# EAGLE schematic eagle-schematic (EAGLE 9.6.2)
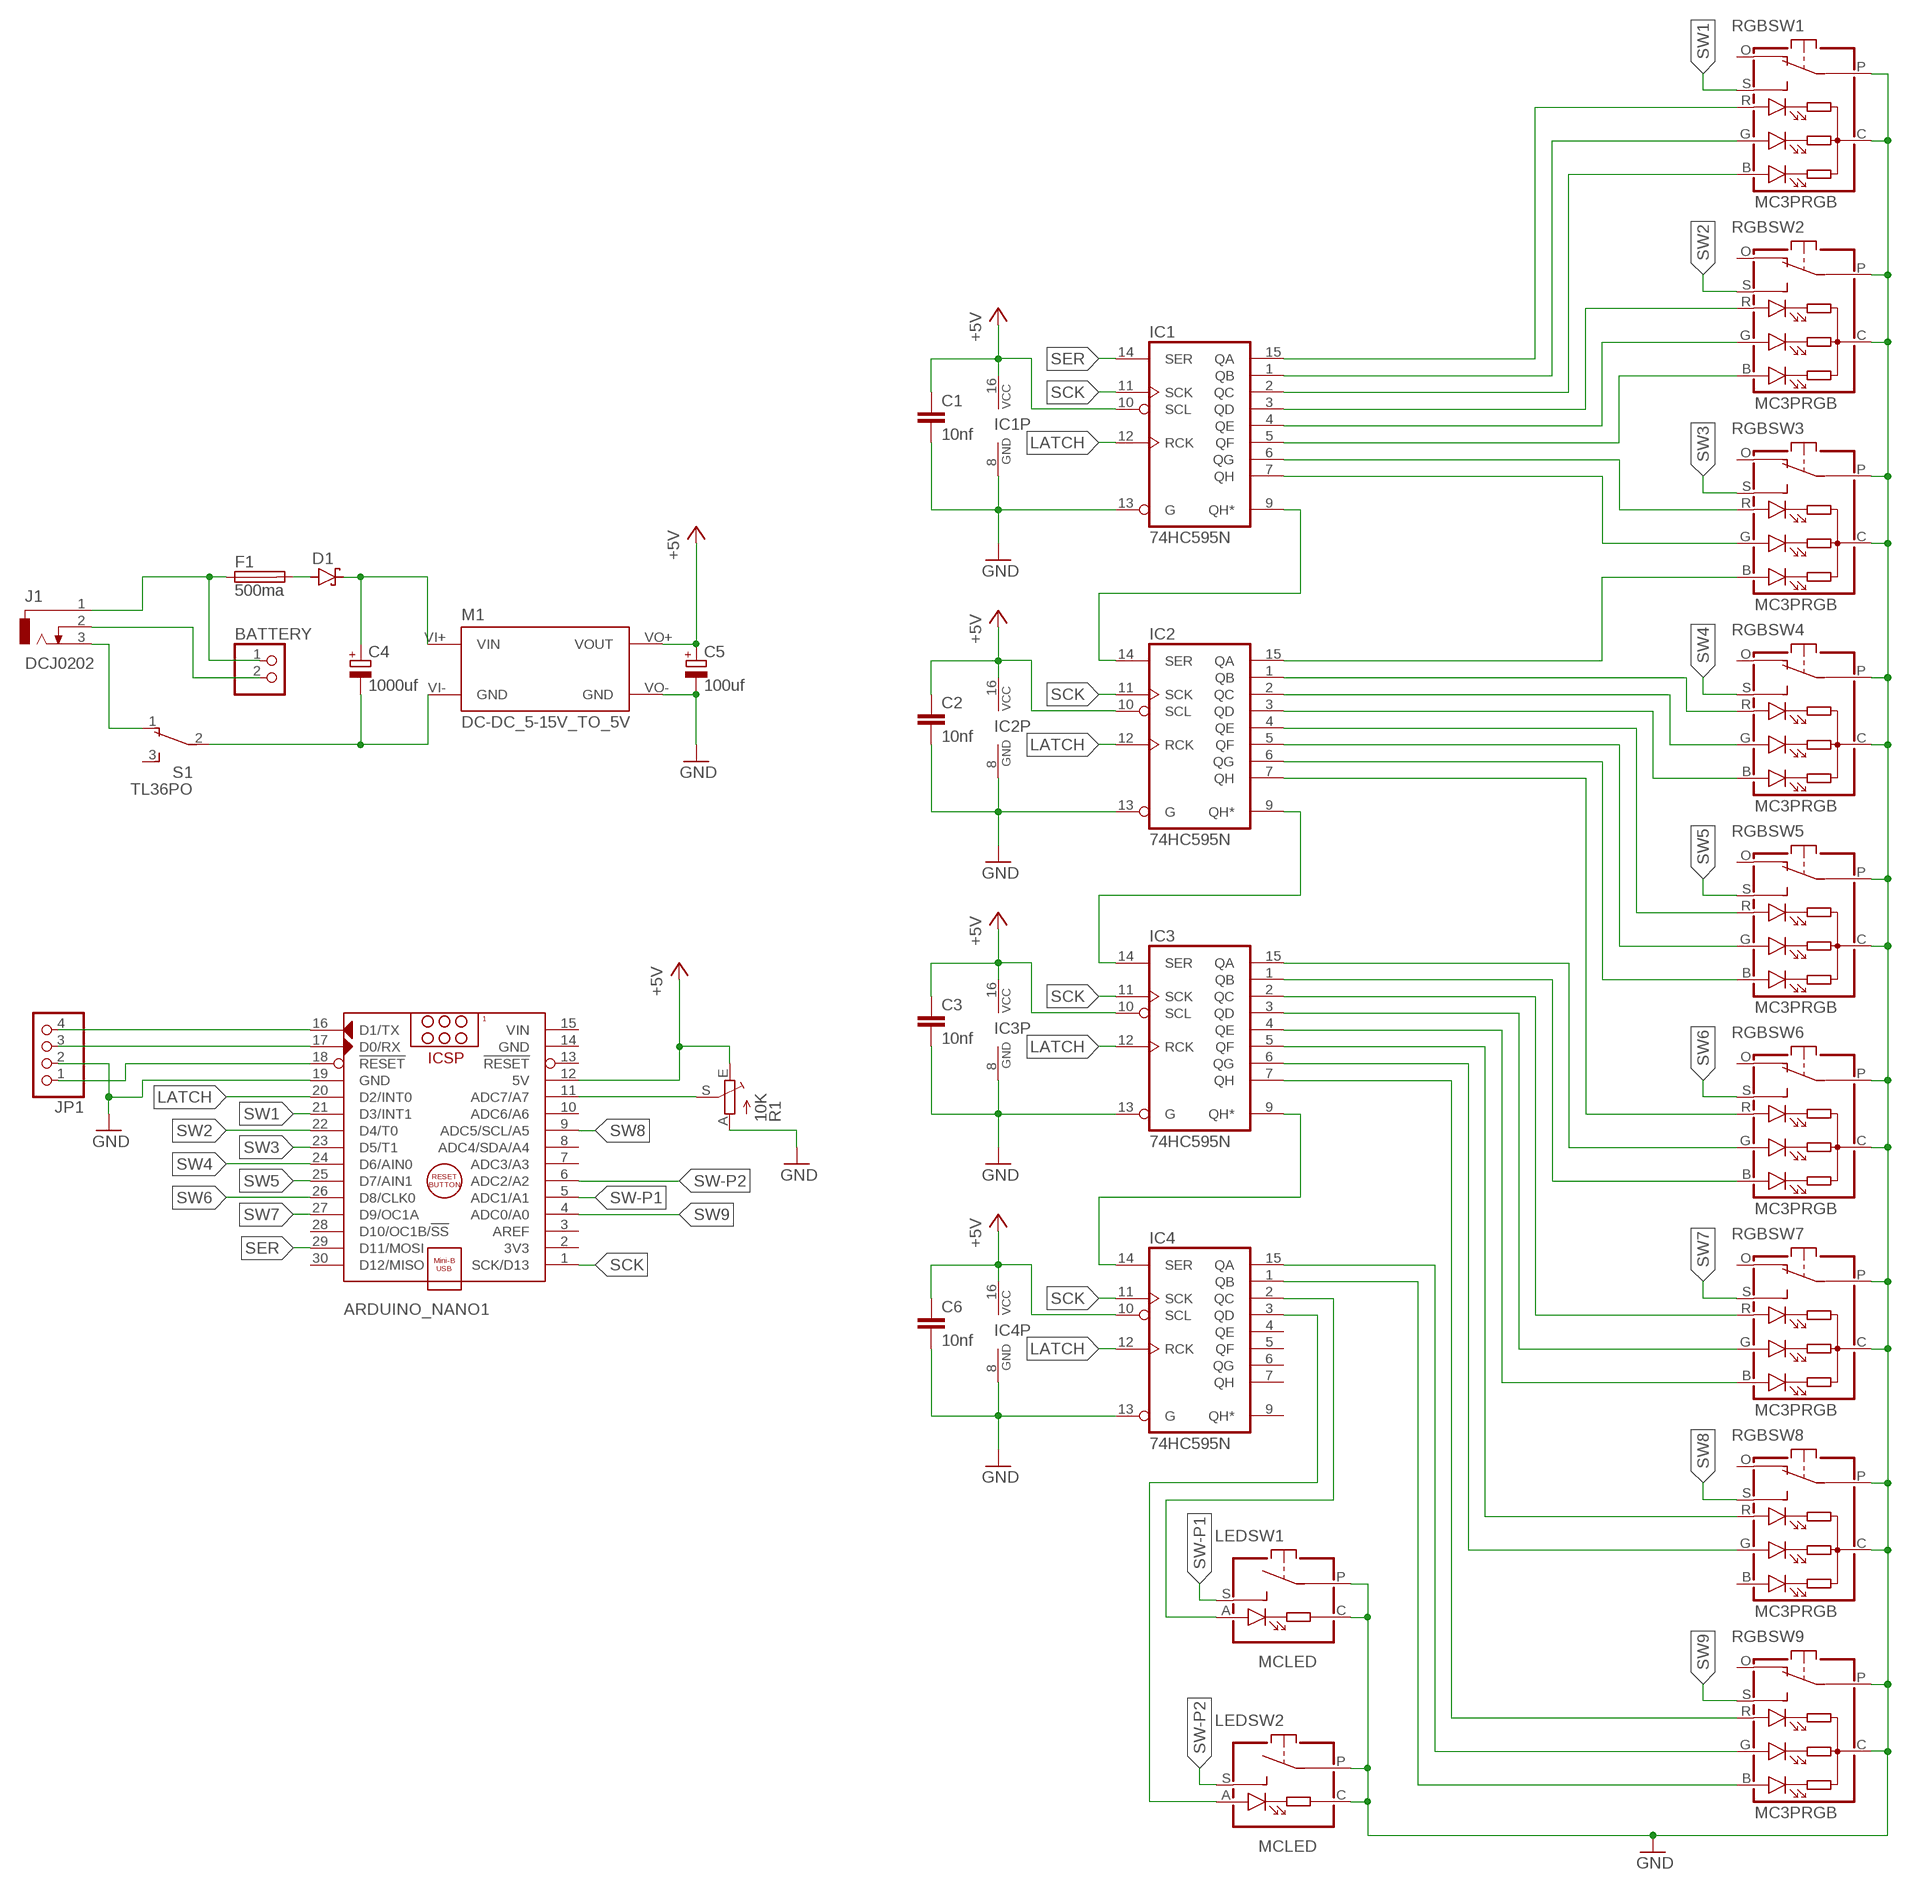
[diagram p0: schematic, sheet 1]

## Parts
ARDUINO_NANO1  ARDUINO_NANO  [ARDUINO_NANO]
BATTERY  PINHD-1X2  [1X02]
C1  10nf  C-EU025-024X044  [C025-024X044]
C2  10nf  C-EU025-024X044  [C025-024X044]
C3  10nf  C-EU025-024X044  [C025-024X044]
C4  1000uf  CPOL-EUE5-13  [E5-13]
C5  100uf  CPOL-EUE2.5-5  [E2,5-5]
C6  10nf  C-EU025-024X044  [C025-024X044]
D1  SCHOTTKY-DIODECB417-15  [CB417-15]
F1  500ma  FUSEBLANK_5X20MM  [FUSE_HOLDER_5X20MM]
IC1  74HC595N  [DIL16]
IC2  74HC595N  [DIL16]
IC3  74HC595N  [DIL16]
IC4  74HC595N  [DIL16]
J1  DCJ0202  [DCJ0202]
JP1  PINHD-1X4  [1X04]
LEDSW1  MCLED  [1X04]
LEDSW2  MCLED  [1X04]
M1  DC-DC_5-15V_TO_5V  DC-DC_AUTO_BOOST_BUCK_CONVERTER_MODULE_DC_2.5-15VTO3.3-4.2-5-9-12V  [DC-DC_AUTO_BOOST_BUCK_CONVERTER_MODULE_DC_2.5-15VTO3.3-4.2-5-9-12V]
R1  10K  TRIM_EU-CIP20C-4MM  [CIP20C-4MM]
RGBSW1  MC3PRGB  [1X07]
RGBSW2  MC3PRGB  [1X07]
RGBSW3  MC3PRGB  [1X07]
RGBSW4  MC3PRGB  [1X07]
RGBSW5  MC3PRGB  [1X07]
RGBSW6  MC3PRGB  [1X07]
RGBSW7  MC3PRGB  [1X07]
RGBSW8  MC3PRGB  [1X07]
RGBSW9  MC3PRGB  [1X07]
S1  TL36PO  [TL3XPO]

## Nets
+5V: ARDUINO_NANO1.12(5V) C1.1 C2.1 C3.1 C5.+ C6.1 IC1.10(SCL) IC1.16(VCC) IC2.10(SCL) IC2.16(VCC) IC3.10(SCL) IC3.16(VCC) IC4.10(SCL) IC4.16(VCC) M1.VO+(VOUT) R1.E
GND: ARDUINO_NANO1.19(GND) C1.2 C2.2 C3.2 C5.- C6.2 IC1.8(GND) IC1.13(G) IC2.8(GND) IC2.13(G) IC3.8(GND) IC3.13(G) IC4.8(GND) IC4.13(G) JP1.2 LEDSW1.C LEDSW1.P LEDSW2.C LEDSW2.P M1.VO-(GND) R1.A RGBSW1.C RGBSW1.P RGBSW2.C RGBSW2.P RGBSW3.C RGBSW3.P RGBSW4.C RGBSW4.P RGBSW5.C RGBSW5.P RGBSW6.C RGBSW6.P RGBSW7.C RGBSW7.P RGBSW8.C RGBSW8.P RGBSW9.C RGBSW9.P
LATCH: ARDUINO_NANO1.20(D2/INT0) IC1.12(RCK) IC2.12(RCK) IC3.12(RCK) IC4.12(RCK)
N$1: ARDUINO_NANO1.16(D1/TX) JP1.4
N$2: ARDUINO_NANO1.17(D0/RX) JP1.3
N$3: ARDUINO_NANO1.18(!RESET) JP1.1
N$4: D1.A F1.2
N$5: BATTERY.2 J1.2
N$6: J1.3 S1.1(O)
N$7: ARDUINO_NANO1.11(ADC7/A7) R1.S
N$8: C4.+ D1.C M1.VI+(VIN)
N$9: C4.- M1.VI-(GND) S1.2(P)
N$10: IC1.15(QA) RGBSW1.R
N$11: IC1.1(QB) RGBSW1.G
N$12: IC1.2(QC) RGBSW1.B
N$13: IC1.3(QD) RGBSW2.R
N$14: IC1.4(QE) RGBSW2.G
N$15: BATTERY.1 F1.1 J1.1
N$16: IC1.5(QF) RGBSW2.B
N$17: IC1.6(QG) RGBSW3.R
N$18: IC1.7(QH) RGBSW3.G
N$19: IC2.15(QA) RGBSW3.B
N$20: IC2.1(QB) RGBSW4.R
N$21: IC2.2(QC) RGBSW4.G
N$22: IC2.3(QD) RGBSW4.B
N$23: IC2.4(QE) RGBSW5.R
N$24: IC2.5(QF) RGBSW5.G
N$25: IC2.6(QG) RGBSW5.B
N$26: IC2.7(QH) RGBSW6.R
N$27: IC3.15(QA) RGBSW6.G
N$28: IC3.1(QB) RGBSW6.B
N$29: IC3.2(QC) RGBSW7.R
N$30: IC3.3(QD) RGBSW7.G
N$31: IC3.4(QE) RGBSW7.B
N$32: IC3.5(QF) RGBSW8.R
N$33: IC3.6(QG) RGBSW8.G
N$34: IC3.7(QH) RGBSW9.R
N$35: IC4.15(QA) RGBSW9.G
N$36: IC4.1(QB) RGBSW9.B
N$40: IC4.2(QC) LEDSW1.A
N$41: IC4.3(QD) LEDSW2.A
SCK: ARDUINO_NANO1.1(SCK/D13) IC1.11(SCK) IC2.11(SCK) IC3.11(SCK) IC4.11(SCK)
SER: ARDUINO_NANO1.29(D11/MOSI) IC1.9(QH*) IC1.14(SER) IC2.9(QH*) IC2.14(SER) IC3.14(SER)
SER1: IC3.9(QH*) IC4.14(SER)
SW1: ARDUINO_NANO1.21(D3/INT1) RGBSW1.S
SW2: ARDUINO_NANO1.22(D4/T0) RGBSW2.S
SW3: ARDUINO_NANO1.23(D5/T1) RGBSW3.S
SW4: ARDUINO_NANO1.24(D6/AIN0) RGBSW4.S
SW5: ARDUINO_NANO1.25(D7/AIN1) RGBSW5.S
SW6: ARDUINO_NANO1.26(D8/CLK0) RGBSW6.S
SW7: ARDUINO_NANO1.27(D9/OC1A) RGBSW7.S
SW8: ARDUINO_NANO1.9(ADC5/SCL/A5) RGBSW8.S
SW9: ARDUINO_NANO1.4(ADC0/A0) RGBSW9.S
SW-P1: ARDUINO_NANO1.5(ADC1/A1) LEDSW1.S
SW-P2: ARDUINO_NANO1.6(ADC2/A2) LEDSW2.S
Unconnected: ARDUINO_NANO1.2(3V3) ARDUINO_NANO1.3(AREF) ARDUINO_NANO1.7(ADC3/A3) ARDUINO_NANO1.8(ADC4/SDA/A4) ARDUINO_NANO1.10(ADC6/A6) ARDUINO_NANO1.13(!RESET) ARDUINO_NANO1.28(D10/OC1B/!SS) ARDUINO_NANO1.30(D12/MISO) IC4.4(QE) IC4.5(QF) IC4.6(QG) IC4.7(QH) IC4.9(QH*) RGBSW1.O RGBSW2.O RGBSW3.O RGBSW4.O RGBSW5.O RGBSW6.O RGBSW7.O RGBSW8.B RGBSW8.O RGBSW9.O S1.3(S)

## Power pins joined to a net without a drawn wire
GND: ARDUINO_NANO1.14(GND)
VIN: ARDUINO_NANO1.15(VIN)

## Library data of the parts
ARDUINO_NANO1 = ArduinoNanoV30:ARDUINO_NANO: Arduino Nano V3.0 Module Overview: The Arduino Nano is a small, complete, and breadboard-friendly board based on the ATmega328 (Arduino Nano 3.x) or ATmega168 (Arduino Nano 2.x). It has more or less the same functionality of the Arduino Duemilanove, but in a different package. It lacks only a DC power jack, and works with a Mini-B USB cable instead of a standard one. The Nano was designed and is being produced by Gravitech <http://www.gravitech.us/arna30wiatp.html>. General specifications: Item Value Microcontroller Atmel ATmega168 or ATmega328 Operating Voltage (logic level) 5 V Input Voltage (recommended) 7-12 V Input Voltage (limits) 6-20 V Digital I/O Pins 14 (of which 6 provide PWM output) Analog Input Pins 8 DC Current per I/O Pin 40 mA Flash Memory 16 KB (ATmega168) or 32 KB (ATmega328) of which 2 KB used by bootloader SRAM 1 KB (ATmega168) or 2 KB (ATmega328) EEPROM 512 bytes (ATmega168) or 1 KB (ATmega328) Clock Speed 16 MHz Dimensions (Inches) 0.73" x 1.70" Dimensions (mm) 18mm x 45mm Overall height About 9 mm (not including pins) Weigth 5 g Power: The Arduino Nano can be powered via the Mini-B USB connection, 6-20V unregulated external power supply (pin 30), or 5V regulated external power supply (pin 27). The power source is automatically selected to the highest voltage source. Memory: The ATmega168 has 16 KB of flash memory for storing code (of which 2 KB is used for the bootloader); the ATmega328 has 32 KB, (also with 2 KB used for the bootloader). The ATmega168 has 1 KB of SRAM and 512 bytes of EEPROM (which can be read and written with the EEPROM library); the ATmega328 has 2 KB of SRAM and 1 KB of EEPROM. Input and Output: Each of the 14 digital pins on the Nano can be used as an input or output, using pinMode(), digitalWrite(), and digitalRead() functions. They operate at 5 volts. Each pin can provide or receive a maximum of 40 mA and has an internal pull-up resistor (disconnected by default) of 20-50 kOhms. In addition, some pins have specialized functions. Visit Arduino - ArduinoBoardNano <https://www.arduino.cc/en/Main/ArduinoBoardNano>
BATTERY = pinhead:PINHD-1X2: PIN HEADER
C1-C3 C6 = rcl:C-EU: CAPACITOR, European symbol; SPICEPREFIX: C
C4 C5 = rcl:CPOL-EU: POLARIZED CAPACITOR, European symbol; SPICEPREFIX: C
D1 = diode:SCHOTTKY-DIODE: Schottky Diode
F1 = fuse:FUSE: Fuse; OC_FARNELL: unknown; OC_NEWARK: unknown
IC1-IC4 = 74xx-eu:74*595: 8-bit SHIFT REGISTER, output latch
J1 = con-jack:DCJ0202: DC POWER JACK Source: DCJ0202.pdf; OC_FARNELL: unknown; OC_NEWARK: unknown
JP1 = pinhead:PINHD-1X4: PIN HEADER
LEDSW1 LEDSW2 = switches-custom:MCLED
M1 = aliexpress power converter modules:DC-DC_AUTO_BOOST_BUCK_CONVERTER_MODULE_DC_2.5-15VTO3.3-4.2-5-9-12V
R1 = pot:TRIM_EU-: POTENTIOMETER
RGBSW1-RGBSW9 = switches-custom:MC3PRGB
S1 = switch:TL36PO: TINY SWITCH ON - ON Source: http://www2.produktinfo.conrad.com/datenblaetter/700000-724999/705152-da-01-de-Subminiaturschalter_TL_36YO.pdf